# Altium schematic sheet 03_BLBB_Peripheral.SchDoc
size A4; SheetNumber: 4; SheetTotal: 4
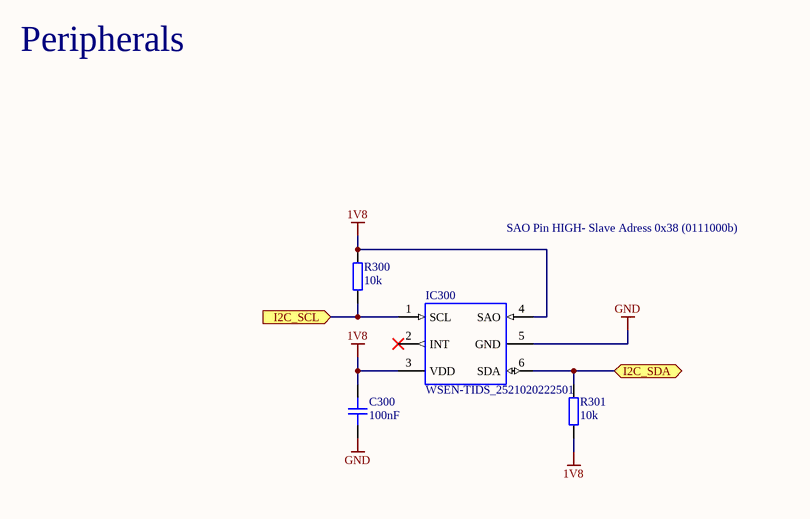
[diagram p0: 03_BLBB_Peripheral.SchDoc]

## Parts
C300  100nF  [CAP_0603]
IC300  WSEN-TIDS_2521020222501  [WSEN-TIDS_2521020222501]
R300  10k  [RES_0603]
R301  10k  [RES_0603]

## Ports
I2C_SCL (in), I2C_SDA (bidir)

## Nets
1V8: C300.2 IC300.3(VDD) IC300.4(SAO) R300.2 R301.1
GND: C300.1 IC300.5(GND)
I2C_SCL: IC300.1(SCL) R300.1 ; port I2C_SCL
I2C_SDA: IC300.6(SDA) R301.2 ; port I2C_SDA

Not connected (* = marked no-connect by the designer): IC300 2(INT)*

## Notes on the sheet
- Peripherals
- SAO Pin HIGH- Slave Adress 0x38 (0111000b)

## Library data of the parts
C300 = CAP_0603_10V: Capacitor SMD 0603 10V
IC300 = WSEN-TIDS_2521020222501: Manufacturer: Würth Elektronik; NR: 2521020222501
R300 R301 = RES_0603: Resistor SMD 0603